# EAGLE design main-debug (EAGLE 6.4)
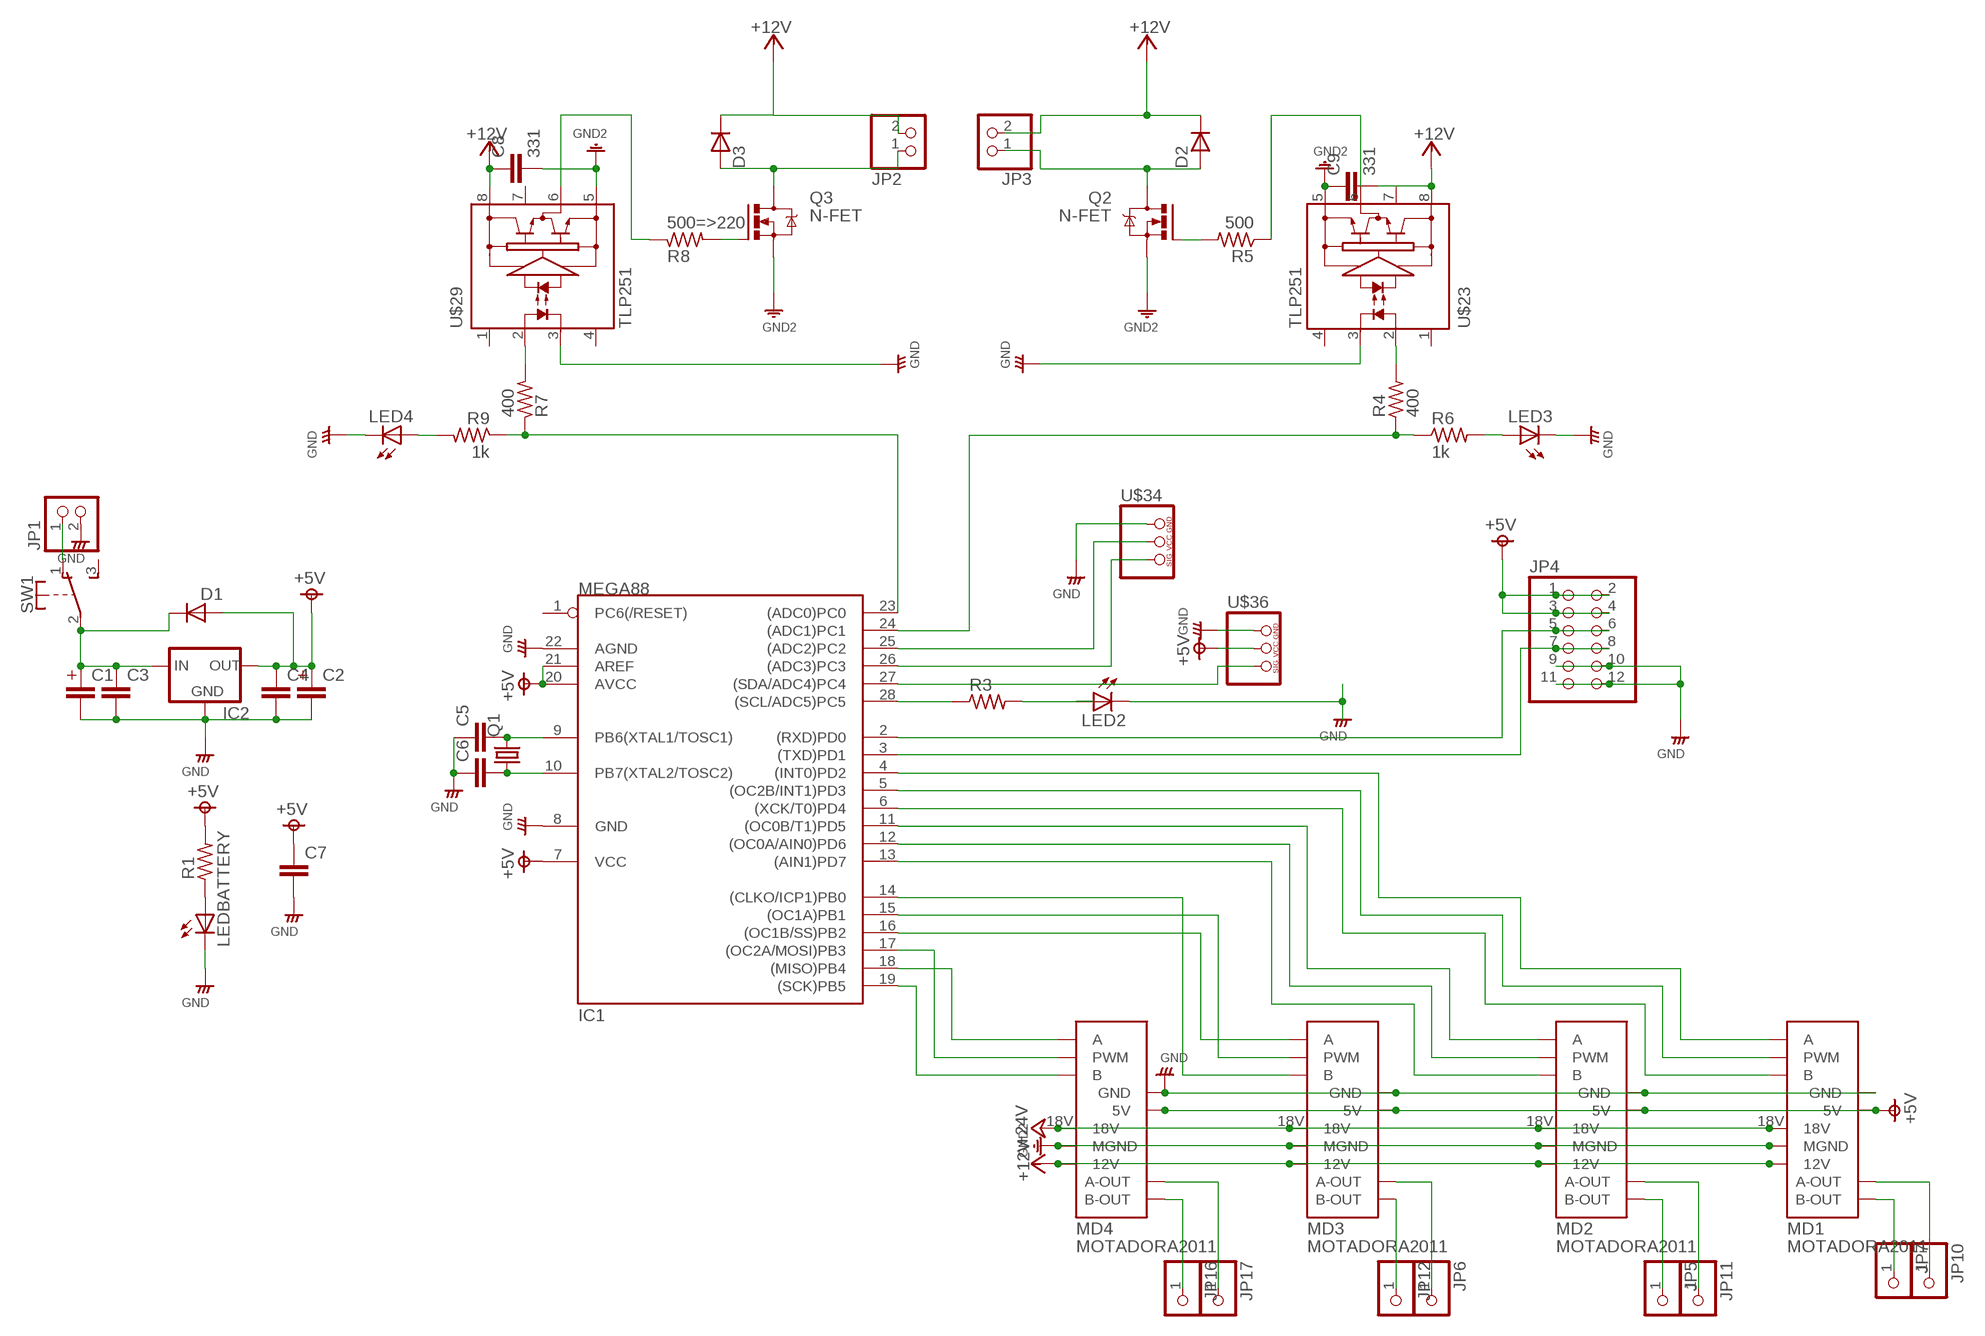
[diagram p0: schematic, sheet 1]

## Parts
C1  CAPACITOR-330U  [C_330U]
C2  CAPACITOR-330U  [C_330U]
C3  MLCC-3  [MLCC_50]
C4  MLCC-3  [MLCC_50]
C5  MLCC-2  [MLCC_25]
C6  MLCC-2  [MLCC_25]
C7  MLCC-2  [MLCC_25]
C8  331  MLCC-3  [MLCC_50]
C9  331  MLCC-3  [MLCC_50]
D1  DIODE_3  [DIODE_3]
D2  DIODE_4  [DIODE_4]
D3  DIODE_4  [DIODE_4]
IC1  MEGA88  [DIL28-3]
IC2  78  [78XX]
JP1  PINHD-1X2"  [1*02]
JP2  PINHD-1X2  [1X02]
JP3  PINHD-1X2  [1X02]
JP4  PINHD-2X6  [2X06]
JP5  PINHD-1X1  [1X01]
JP6  PINHD-1X1  [1X01]
JP7  PINHD-1X1  [1X01]
JP10  PINHD-1X1  [1X01]
JP11  PINHD-1X1  [1X01]
JP12  PINHD-1X1  [1X01]
JP16  PINHD-1X1  [1X01]
JP17  PINHD-1X1  [1X01]
LED2  LED5MM  [LED5MM]
LED3  LED5MM  [LED5MM]
LED4  LED5MM  [LED5MM]
LEDBATTERY  LED5MM  [LED5MM]
MD1  MOTADORA2011  [MOTADORA2010]
MD2  MOTADORA2011  [MOTADORA2010]
MD3  MOTADORA2011  [MOTADORA2010]
MD4  MOTADORA2011  [MOTADORA2010]
Q1  CTYSTALHC49/S  [HC49/S]
Q2  N-FET  [TO-220V]
Q3  N-FET  [TO-220V]
R1  RESISTORS-3  [R_0.3]
R3  RESISTORS-3  [R_0.3]
R4  400  RESISTORS-3  [R_0.3]
R5  500  RESISTORS-3  [R_0.3]
R6  1k  RESISTORS-3  [R_0.3]
R7  400  RESISTORS-3  [R_0.3]
R8  500=>220  RESISTORS-3  [R_0.3]
R9  1k  RESISTORS-3  [R_0.3]
SW1  TOGGLE  [9450-2]
U$23  TLP251  [DIP8]
U$29  TLP251  [DIP8]
U$34  PINHD-SENSOR  [1*03(KIKAKU)]
U$36  PINHD-SENSOR  [1*03(KIKAKU)]

## Nets
+5V: C2.P$1 C4.1 C7.1 D1.A IC1.7(VCC) IC1.20(AVCC) IC1.21(AREF) IC2.P$3(OUT) JP4.1 JP4.2 JP4.3 JP4.4 MD1.5V MD2.5V MD3.5V MD4.5V R1.2 U$36.VCC
+12V: C8.1 C9.2 D2.C D3.C JP2.2 JP3.2 MD1.12V MD2.12V MD3.12V MD4.12V U$23.8 U$29.8
+24V: MD1.18V MD2.18V MD3.18V MD4.18V
GND: C1.P$2 C2.P$2 C3.2 C4.2 C5.1 C6.1 C7.2 IC1.8(GND) IC1.22(AGND) IC2.P$2(GND) JP1.2 JP4.9 JP4.10 JP4.11 JP4.12 LED2.K(C) LED3.K(C) LED4.K(C) LEDBATTERY.K(C) MD1.GND MD2.GND MD3.GND MD4.GND U$23.3 U$29.3 U$34.GND U$36.GND
GND12: C8.2 C9.1 MD1.MGND MD2.MGND MD3.MGND MD4.MGND Q2.3(S) Q3.3(S) U$23.5 U$29.5 ; supply symbol labelled GND2
N$1: C5.2 IC1.9(PB6(XTAL1/TOSC1)) Q1.2
N$2: C6.2 IC1.10(PB7(XTAL2/TOSC2)) Q1.1
N$3: JP1.1 SW1.1(O)
N$5: C1.P$1 C3.1 D1.C IC2.P$1(IN) SW1.2(P)
N$6: IC1.27((SDA/ADC4)PC4) U$36.SIG
N$7: IC1.23((ADC0)PC0) R7.1 R9.1
N$8: IC1.24((ADC1)PC1) R4.1 R6.1
N$9: IC1.2((RXD)PD0) JP4.5 JP4.6
N$10: IC1.18((MISO)PB4) MD4.A
N$11: IC1.6((XCK/T0)PD4) MD1.B
N$12: IC1.4((INT0)PD2) MD1.A
N$13: IC1.19((SCK)PB5) MD4.B
N$14: IC1.3((TXD)PD1) JP4.7 JP4.8
N$16: IC1.28((SCL/ADC5)PC5) R3.1
N$18: IC1.5((OC2B/INT1)PD3) MD1.PWM
N$19: IC1.17((OC2A/MOSI)PB3) MD4.PWM
N$20: IC1.16((OC1B/SS)PB2) MD3.A
N$21: IC1.15((OC1A)PB1) MD3.PWM
N$22: IC1.14((CLKO/ICP1)PB0) MD3.B
N$23: IC1.13((AIN1)PD7) MD2.B
N$24: IC1.12((OC0A/AIN0)PD6) MD2.PWM
N$25: IC1.11((OC0B/T1)PD5) MD2.A
N$26: JP12.1 MD3.B-OUT
N$27: JP6.1 MD3.A-OUT
N$28: JP11.1 MD2.A-OUT
N$29: JP7.1 MD1.B-OUT
N$30: JP10.1 MD1.A-OUT
N$31: D3.A JP2.1 Q3.2(D)
N$32: Q2.1(G) R5.2
N$33: JP5.1 MD2.B-OUT
N$34: JP16.1 MD4.B-OUT
N$35: JP17.1 MD4.A-OUT
N$36: D2.A JP3.1 Q2.2(D)
N$37: R4.2 U$23.2
N$38: R5.1 U$23.6
N$39: LED3.A R6.2
N$40: LEDBATTERY.A R1.1
N$41: Q3.1(G) R8.2
N$42: IC1.25((ADC2)PC2) U$34.VCC
N$43: R7.2 U$29.2
N$44: R8.1 U$29.6
N$45: LED4.A R9.2
N$46: IC1.26((ADC3)PC3) U$34.SIG
N$47: LED2.A R3.2
Unconnected: IC1.1(PC6(/RESET)) SW1.3(S) U$23.1 U$23.4 U$23.7 U$29.1 U$29.4 U$29.7

## Library data of the parts
C1 C2 = rcl__s:CAPACITOR
C3-C9 = rcl__s:MLCC: CAPACITOR, European symbol
D1-D3 = diode_s:DIODE
IC1 = avr_s:MEGA88: MICROCONTROLLER 8 Kbytes FLASH 1 kbytes SRAM 512 bytes EEPROM USART 4-channel 10 bit ADC 2-channel 8 bit ADC Source: avr.lbr
IC2 = regulator_s:78*: VOLTAGE REGULATOR
JP1-JP3 = pinhead_s:PINHD-1X2: PIN HEADER
JP4 = pinhead_s:PINHD-2X6: PIN HEADER
JP5-JP7 JP10-JP12 JP16 JP17 = pinhead_s:PINHD-1X1: PIN HEADER
LED2-LED4 LEDBATTERY = LED_s:LED: LED OSRAM: - CHIPLED LG R971, LG N971, LY N971, LG Q971, LY Q971, LO R971, LY R971 LH N974, LH R974 LS Q976, LO Q976, LY Q976 LO Q996 - Hyper CHIPLED LW Q18S LB Q993, LB Q99A, LB R99A - SideLED LS A670, LO A670, LY A670, LG A670, LP A670 LB A673, LV A673, LT A673, LW A673 LH A674 LY A675 LS A676, LA A676, LO A676, LY A676, LW A676 LS A679, LY A679, LG A679 - Hyper Micro SIDELED® LS Y876, LA Y876, LO Y876, LY Y876 LT Y87S - SmartLED LW L88C, LW L88S LB L89C, LB L89S, LG L890 LS L89K, LO L89K, LY L89K LS L896, LA L896, LO L896, LY L896 - TOPLED LS T670, LO T670, LY T670, LG T670, LP T670 LSG T670, LSP T670, LSY T670, LOP T670, LYG T670 LG T671, LOG T671, LSG T671 LB T673, LV T673, LT T673, LW T673 LH T674 LS T676, LA T676, LO T676, LY T676, LB T676, LH T676, LSB T676, LW T676 LB T67C, LV T67C, LT T67C, LS T67K, LO T67K, LY T67K, LW E67C LS E67B, LA E67B, LO E67B, LY E67B, LB E67C, LV E67C, LT E67C LW T67C LS T679, LY T679, LG T679 LS T770, LO T770, LY T770, LG T770, LP T770 LB T773, LV T773, LT T773, LW T773 LH T774 LS E675, LA E675, LY E675, LS T675 LS T776, LA T776, LO T776, LY T776, LB T776 LHGB T686 LT T68C, LB T68C - Hyper Mini TOPLED® LB M676 - Mini TOPLED Santana® LG M470 LS M47K, LO M47K, LY M47K Source: http://www.osram.convergy.de - LUMILED® LXK2-PW12-R00, LXK2-PW12-S00, LXK2-PW14-U00, LXK2-PW14-V00 LXK2-PM12-R00, LXK2-PM12-S00, LXK2-PM14-U00 LXK2-PE12-Q00, LXK2-PE12-R00, LXK2-PE12-S00, LXK2-PE14-T00, LXK2-PE14-U00 LXK2-PB12-K00, LXK2-PB12-L00, LXK2-PB12-M00, LXK2-PB14-N00, LXK2-PB14-P00, LXK2-PB14-Q00 LXK2-PR12-L00, LXK2-PR12-M00, LXK2-PR14-Q00, LXK2-PR14-R00 LXK2-PD12-Q00, LXK2-PD12-R00, LXK2-PD12-S00 LXK2-PH12-R00, LXK2-PH12-S00 LXK2-PL12-P00, LXK2-PL12-Q00, LXK2-PL12-R00 Source: www.luxeon.com
MD1-MD4 = motadora2011:MOTADORA2011
Q1 = crystal_s:CTYSTAL: CRYSTAL
Q2 Q3 = FET_s:N-FET
R1 R3-R9 = rcl__s:RESISTORS
SW1 = switch_s:TOGGLE
U$23 U$29 = photocoupler_s:TLP251
U$34 U$36 = pinhead_s:PINHD-SENSOR

## Board
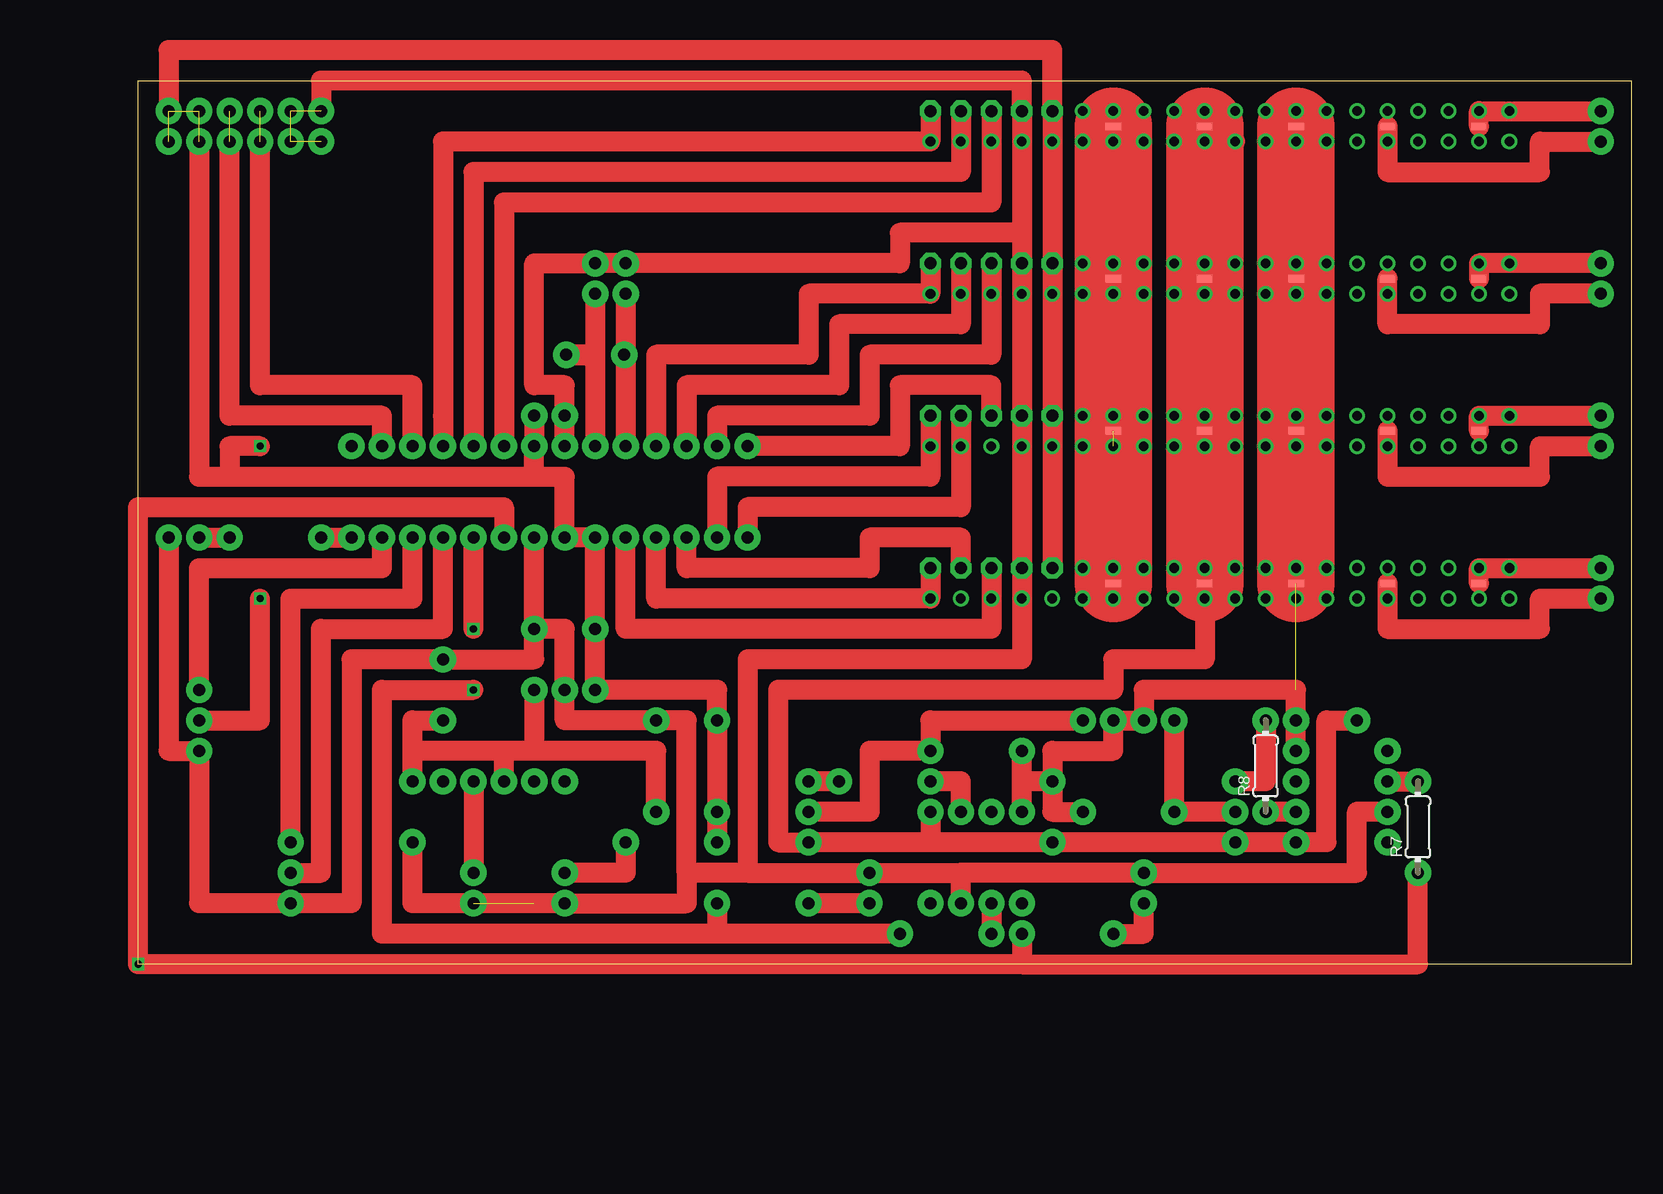
[diagram p1: board, top side]
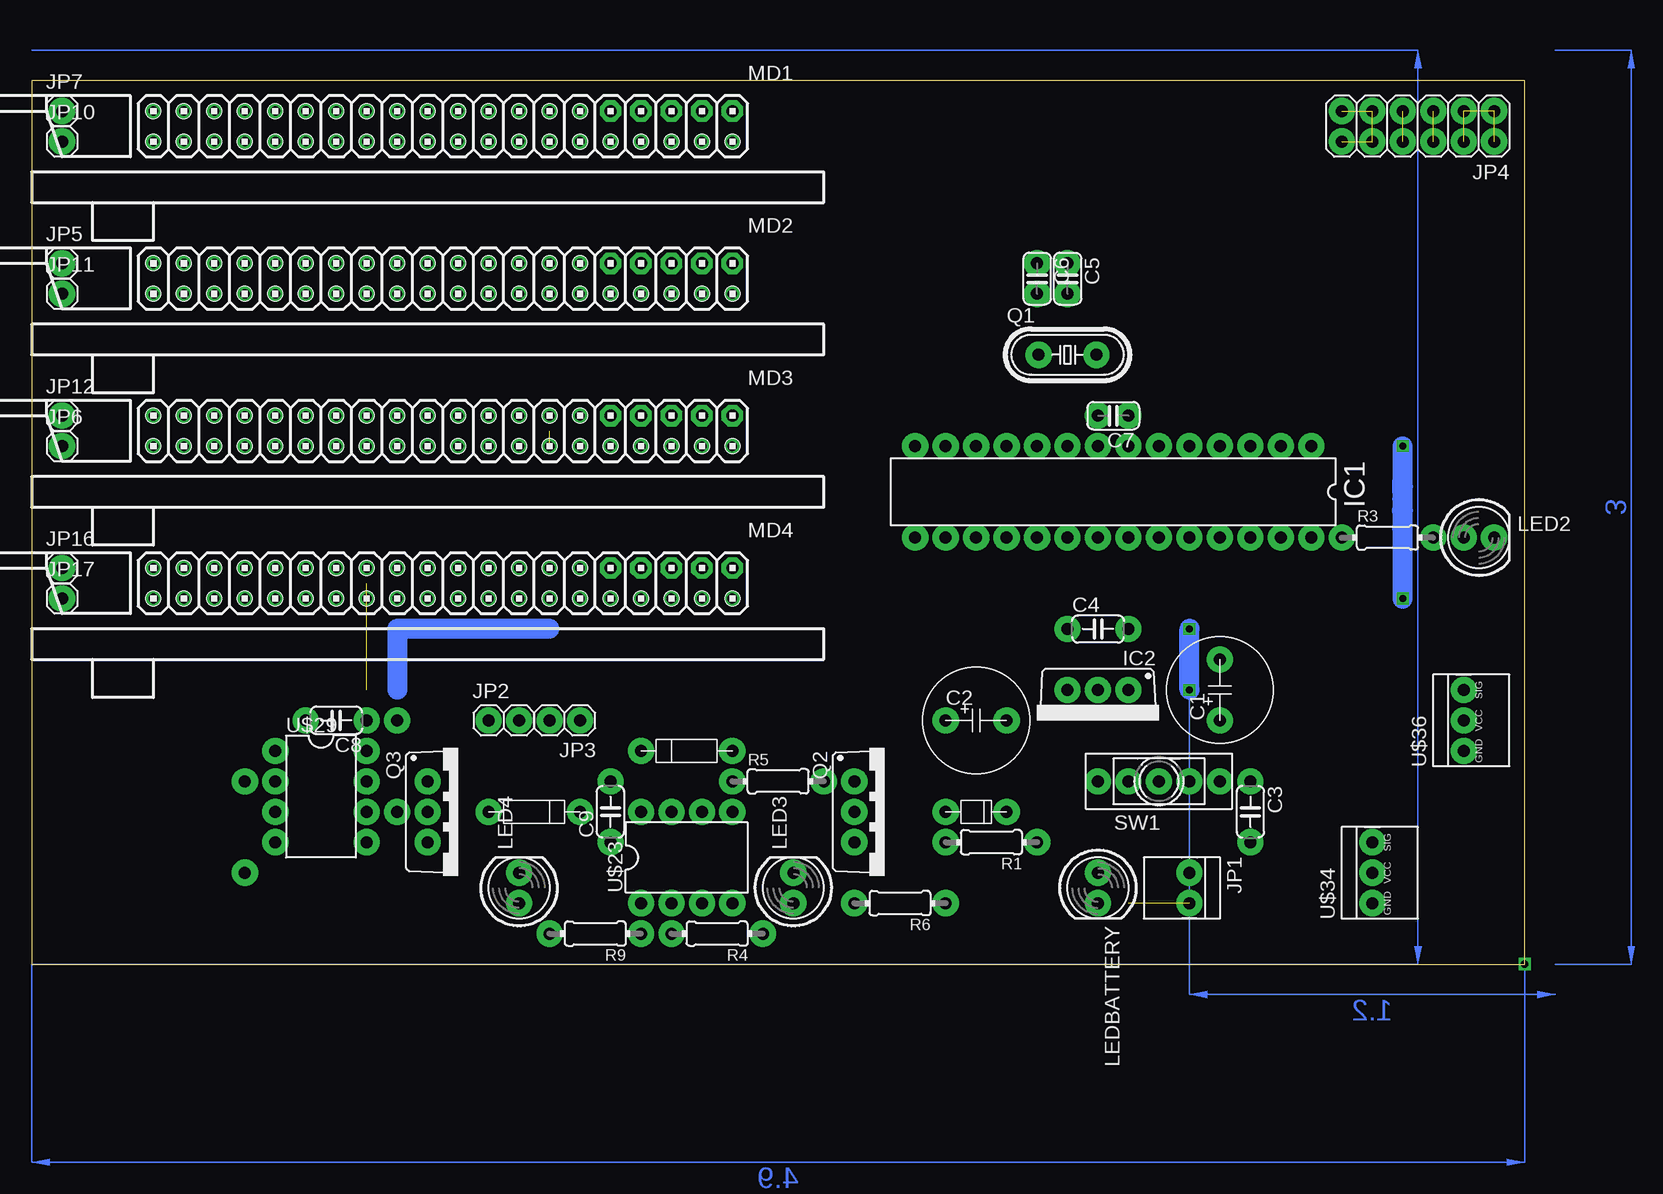
[diagram p2: board, bottom side, seen from below]

Size 124.46 x 73.66 mm. Coordinates in mm from the lower left corner, seen from the top.
Outline: 124.46,0 0,0 0,73.66 124.46,73.66 124.46,0
Copper layers (1*16): Top 0.035mm / dielectric 1.5mm / Bottom 0.035mm
Design rules "default": minimum track width 10mil, minimum drill 24mil, track to track 8mil, track to pad 8mil, pad to pad 8mil, via to via 8mil, smd to smd 8mil, copper to edge 40mil, drill to drill 8mil, minimum pad ring 10mil, minimum via ring 8mil, stop-mask expansion 4mil, vias tented up to drill 0mil, thermal gap 10mil

### Footprints (pad centres in the part's own frame; a part is rotated, then mirrored left to right if it is on the bottom)
C_330U = drill 1 pad 2.184: P$1 -2.54,0; P$2 2.54,0
MLCC_50 = drill 1 pad 2.184: 1 -2.54,0; 2 2.54,0
MLCC_25 = drill 1 pad 2.184: 1 -1.27,0; 2 1.27,0
DIODE_3 = drill 1 pad 2.184: A -2.54,0; C 2.54,0
DIODE_4 = drill 1 pad 2.184: A -5.08,0; C 2.54,0
DIL28-3 = drill 1 pad 2.184: 1 -3.81,16.51; 2 -3.81,13.97; 3 -3.81,11.43; 4 -3.81,8.89; 5 -3.81,6.35; 6 -3.81,3.81; 7 -3.81,1.27; 8 -3.81,-1.27; 9 -3.81,-3.81; 10 -3.81,-6.35; 11 -3.81,-8.89; 12 -3.81,-11.43; 13 -3.81,-13.97; 14 -3.81,-16.51; 15 3.81,-16.51; 16 3.81,-13.97; 17 3.81,-11.43; 18 3.81,-8.89; 19 3.81,-6.35; 20 3.81,-3.81; 21 3.81,-1.27; 22 3.81,1.27; 23 3.81,3.81; 24 3.81,6.35; 25 3.81,8.89; 26 3.81,11.43; 27 3.81,13.97; 28 3.81,16.51
78XX = drill 1 pad 2.184: P$1 -2.54,0; P$2 0,0; P$3 2.54,0
1*02 = drill 1 pad 2.184: 1 -1.27,0; 2 1.27,0
1X02 = drill 1 pad 2.184: 1 -1.27,0; 2 1.27,0
2X06 = drill 1 pad 2.184: 1 -6.35,-1.27; 2 -6.35,1.27; 3 -3.81,-1.27; 4 -3.81,1.27; 5 -1.27,-1.27; 6 -1.27,1.27; 7 1.27,-1.27; 8 1.27,1.27; 9 3.81,-1.27; 10 3.81,1.27; 11 6.35,-1.27; 12 6.35,1.27
1X01 = drill 1 pad 2.184: 1 0,0
LED5MM = drill 1 pad 2.184: A -1.27,0; K 1.27,0
MOTADORA2010 = drill 1.001 pad 1.778 octagon: 5V -15.24,-1.27; A -25.4,-1.27; B -20.32,-1.27; GND -17.78,-1.27; PWM -22.86,-1.27 | smd 1.27 x 0.635 bottom: 12V 5.08,0; 18V -10.16,0; A-OUT 12.7,0; B-OUT 20.32,0; MGND -2.54,0 | drill 0.8: P$1 -25.4,1.27; P$2 -22.86,1.27; P$3 -20.32,1.27; P$4 -17.78,1.27; P$5 -15.24,1.27; P$6 -12.7,1.27; P$7 -12.7,-1.27; P$8 -10.16,-1.27; P$9 -10.16,1.27; P$10 -7.62,1.27; P$11 -7.62,-1.27; P$12 -5.08,-1.27; P$13 -5.08,1.27; P$14 -2.54,1.27; P$15 -2.54,-1.27; P$16 0,-1.27; P$17 0,1.27; P$18 2.54,1.27; P$19 5.08,1.27; P$20 5.08,-1.27; P$21 2.54,-1.27; P$22 7.62,-1.27; P$23 7.62,1.27; P$24 10.16,1.27; P$25 10.16,-1.27; P$26 12.7,1.27; P$27 12.7,-1.27; P$28 15.24,-1.27; P$29 15.24,1.27; P$30 17.78,1.27; P$31 17.78,-1.27; P$32 20.32,-1.27; P$33 20.32,1.27; P$34 22.86,1.27; P$35 22.86,-1.27
HC49/S = drill 1 pad 2.184: 1 -2.413,0; 2 2.413,0
TO-220V = drill 1 pad 2.184: 1 -2.54,0; 2 0,0; 3 2.54,0
R_0.3 = drill 1 pad 2.184: 1 -3.81,0; 2 3.81,0; 3 -3.81,0
9450-2 = drill 1 pad 2.184: 1 -2.54,0; 2 0,0; 3 2.54,0; F1 -5.08,0; F2 5.08,0
DIP8 = drill 1 pad 2.184: 1 -3.81,-3.81; 2 -1.27,-3.81; 3 1.27,-3.81; 4 3.81,-3.81; 5 3.81,3.81; 6 1.27,3.81; 7 -1.27,3.81; 8 -3.81,3.81
1*03(KIKAKU) = drill 1 pad 2.184: GND -2.54,1.27; SIG 2.54,1.27; VCC 0,1.27

### Placement (x,y rotation side)
C1  25.4,22.86 90 bottom
C2  45.72,20.32 0 bottom
C3  22.86,12.7 270 bottom
C4  35.56,27.94 0 bottom
C5  38.1,57.15 270 bottom
C6  40.64,57.15 270 bottom
C7  34.29,45.72 180 bottom
C8  99.06,20.32 180 bottom
C9  76.2,12.7 90 bottom
D1  45.72,12.7 0 bottom
D2  71.12,17.78 180 bottom
D3  81.28,12.7 0 bottom
IC1  34.29,39.37 270 bottom
IC2  35.56,22.86 180 bottom
JP1  27.94,6.35 270 bottom
JP2  85.09,20.32 0 bottom
JP3  80.01,20.32 180 bottom
JP4  8.89,69.85 180 bottom
JP5  121.92,58.42 0 bottom
JP6  121.92,43.18 0 bottom
JP7  121.92,71.12 0 bottom
JP10  121.92,68.58 0 bottom
JP11  121.92,55.88 0 bottom
JP12  121.92,45.72 0 bottom
JP16  121.92,33.02 0 bottom
JP17  121.92,30.48 0 bottom
LED2  3.81,35.56 0 bottom
LED3  60.96,6.35 90 bottom
LED4  83.82,6.35 90 bottom
LEDBATTERY  35.56,6.35 270 bottom
MD1  91.44,69.85 180 bottom
MD2  91.44,57.15 180 bottom
MD3  91.44,44.45 180 bottom
MD4  91.44,31.75 180 bottom
Q1  38.1,50.8 0 bottom
Q2  55.88,12.7 270 bottom
Q3  91.44,12.7 270 bottom
R1  44.45,10.16 180 bottom
R3  11.43,35.56 0 bottom
R4  67.31,2.54 180 bottom
R5  62.23,15.24 0 bottom
R6  52.07,5.08 180 bottom
R7  106.68,11.43 90 top
R8  93.98,16.51 90 top
R9  77.47,2.54 180 bottom
SW1  30.48,15.24 180 bottom
U$23  69.85,8.89 0 bottom
U$29  100.33,13.97 270 bottom
U$34  11.43,7.62 90 bottom
U$36  3.81,20.32 90 bottom

### Tracks (layer width: path | path; a pad name or v marks a point on that pad's centre or on a via)
+5V  (via drill 0.6)  (3 unrouted)
  Top 1.676: C7.1 IC1.7 33.02,40.64 | JP4.4 5.08,40.64 7.62,40.64 | 7.62,40.64 33.02,40.64 | R1.2 D1.A C2.P$1 48.26,22.86 IC2.P$3 C4.1 IC1.20 IC1.21 35.56,40.64 33.02,40.64 | MD4.5V MD3.5V MD2.5V MD1.5V 76.2,76.2 2.54,76.2 JP4.1 | U$36.VCC 10.16,20.32 v10.16,30.48 | v10.16,43.18 7.62,43.18 7.62,40.64
  Bottom 1.676: v10.16,30.48 v10.16,43.18
+12V  (1 unrouted)
  Top 1.676: U$29.8 C8.1 96.52,22.86 83.82,22.86 JP2.2 JP3.2 81.28,17.78 76.2,17.78 C9.2 | U$23.8 73.66,15.24 | C9.2 73.66,15.24 | 73.66,15.24 D2.C | C9.2 76.2,12.7 D3.C
  Top 6.452: MD1.12V MD2.12V MD3.12V MD4.12V
+24V  (1 unrouted)
  Top 0.406: MD1.18V 78.74,69.85 78.74,53.34 81.28,53.34 83.82,53.34 | 83.82,53.34 83.82,43.18 | 83.82,43.18 83.82,40.64 | 83.82,60.96 83.82,53.34 | 83.82,43.18 81.28,43.18
  Top 6.452: MD1.18V MD2.18V 81.28,53.34 81.28,43.18 MD4.18V
GND  (via drill 0.6)  (4 unrouted)
  Top 1.676: 73.66,60.96 MD1.GND 73.66,73.66 15.24,73.66 JP4.11 | 73.66,60.96 MD2.GND MD3.GND MD4.GND 73.66,25.4 50.8,25.4 50.8,7.62 | U$29.3 101.6,12.7 101.6,7.62 LED4.K 68.58,7.62 | LEDBATTERY.K 22.86,5.08 C3.2 | LEDBATTERY.K 33.02,5.08 | LEDBATTERY.K 45.72,5.08 45.72,7.62 | 45.72,7.62 45.72,20.32 C2.P$2 35.56,20.32 IC2.P$2 35.56,27.94 C4.2 | 50.8,7.62 45.72,7.62 | C4.2 33.02,25.4 C1.P$2 17.78,25.4 17.78,5.08 U$34.GND 5.08,5.08 U$36.GND 2.54,17.78 LED2.K | C4.2 IC1.22 | 50.8,7.62 LED3.K 68.58,7.62 | U$23.3 68.58,7.62 | 73.66,60.96 63.5,60.96 63.5,58.42 C6.1 C5.1 33.02,58.42 33.02,48.26 35.56,48.26 C7.2 IC1.8
  other vias: 60.96,7.62
GND12  (via drill 0.6)
  Top 0.406: MD3.MGND 88.9,60.96
  Top 1.676: MD1.MGND 91.44,68.58 | C8.2 99.06,20.32 99.06,10.16 U$29.5 Q3.3 C9.1 66.04,10.16 | U$23.5 66.04,10.16 | 66.04,10.16 Q2.3 53.34,10.16 53.34,22.86 81.28,22.86 81.28,25.4 88.9,25.4 MD4.MGND
  Top 6.452: MD1.MGND 88.9,60.96 MD2.MGND MD3.MGND MD4.MGND
  other vias: 76.2,10.16 76.2,10.16
N$1
  Top 1.676: C5.2 38.1,50.8 Q1.2 38.1,50.67 IC1.9
N$2
  Top 1.676: IC1.10 C6.2 40.64,50.8 Q1.1
N$3
  Top 1.676: SW1.1 JP1.1
N$4
  Bottom 1.676: 81.28,27.94 93.98,27.94 93.98,22.86
N$5
  Top 1.676: D1.C 43.18,17.78 33.02,17.78 | C3.1 22.86,17.78 | SW1.2 30.48,17.78 | 30.48,17.78 22.86,17.78 | IC2.P$1 33.02,17.78 | 33.02,17.78 30.48,17.78 | 22.86,17.78 22.86,20.32 C1.P$1
N$6
  Top 1.676: IC1.27 20.32,33.02 5.08,33.02 U$36.SIG
N$7  (via drill 0.6)
  Top 1.676: IC1.23 30.48,38.1 0,38.1 v0,0 73.66,0 | R9.1 73.66,0 | 73.66,0 106.68,0 R7.1
N$8  (via drill 0.6)
  Top 1.676: R4.1 48.26,2.54 | R6.1 48.26,2.54 | 48.26,2.54 20.32,2.54 20.32,22.86 v27.94,22.86 | v27.94,27.94 IC1.24
  Bottom 1.676: v27.94,22.86 v27.94,27.94
N$9  (1 unrouted)
  Top 1.676: IC1.2 20.32,45.72 7.62,45.72 JP4.6
N$10
  Top 1.676: IC1.18 43.18,30.48 66.04,30.48 MD4.A
N$11
  Top 1.676: MD1.B 71.12,63.5 30.48,63.5 IC1.6
N$12
  Top 1.676: MD1.A 66.04,68.58 25.4,68.58 IC1.4 25.4,45.72
N$13
  Top 1.676: MD4.B 71.12,27.94 40.64,27.94 IC1.19
N$14  (1 unrouted)
  Top 1.676: IC1.3 22.86,48.26 10.16,48.26 JP4.8
N$16
  Top 1.676: R3.1 IC1.28
N$18
  Top 1.676: MD1.PWM 68.58,66.04 27.94,66.04 IC1.5
N$19
  Top 1.676: MD4.PWM 68.58,35.56 60.96,35.56 60.96,33.02 45.72,33.02 IC1.17
N$20
  Top 1.676: IC1.16 48.26,40.64 66.04,40.64 MD3.A
N$21
  Top 1.676: MD3.PWM 68.58,38.1 50.8,38.1 IC1.15
N$22
  Top 1.676: MD3.B 71.12,48.26 63.5,48.26 63.5,43.18 IC1.14
N$23
  Top 1.676: MD2.B 71.12,50.8 60.96,50.8 60.96,45.72 48.26,45.72 IC1.13
N$24
  Top 1.676: IC1.12 45.72,48.26 58.42,48.26 58.42,53.34 68.58,53.34 MD2.PWM
N$25
  Top 1.676: MD2.A 66.04,55.88 55.88,55.88 55.88,50.8 43.18,50.8 IC1.11
N$26
  Top 1.676: MD3.B-OUT 111.76,45.72 JP12.1
N$27
  Top 1.676: MD3.A-OUT 104.14,40.64 116.84,40.64 116.84,43.18 JP6.1
N$28
  Top 1.676: JP11.1 116.84,55.88 116.84,53.34 104.14,53.34 MD2.A-OUT
N$29
  Top 1.676: MD1.B-OUT 111.76,71.12 JP7.1
N$30
  Top 1.676: MD1.A-OUT 104.14,66.04 116.84,66.04 116.84,68.58 JP10.1
N$31  (via drill 0.6)
  Top 1.676: Q3.2 D3.A JP2.1
  other vias: 91.44,12.7 86.36,12.7
N$32
  Top 1.676: R5.2 Q2.1
N$33
  Top 1.676: JP5.1 111.76,58.42 MD2.B-OUT
N$34
  Top 1.676: MD4.B-OUT 111.76,33.02 JP16.1
N$35
  Top 1.676: MD4.A-OUT 104.14,27.94 116.84,27.94 116.84,30.48 JP17.1
N$36
  Top 1.676: Q2.2 60.96,12.7 60.96,17.78 D2.A 66.04,20.32 JP3.1
N$37
  Top 1.676: U$23.2 R4.2
N$38
  Top 1.676: U$23.6 68.58,15.24 R5.1
N$39
  Top 1.676: LED3.A R6.2
N$40
  Top 1.676: R1.1 40.64,7.62 LEDBATTERY.A
N$41
  Top 1.676: R8.2 93.98,15.24 Q3.1
N$42
  Top 1.676: U$34.VCC 15.24,7.62 15.24,27.94 25.4,27.94 IC1.25
N$43
  Top 1.676: U$29.2 R7.2
N$44
  Top 1.676: U$29.6 R8.1
N$45
  Top 1.676: R9.2 83.82,2.54 LED4.A
N$46
  Top 1.676: U$34.SIG 12.7,30.48 22.86,30.48 IC1.26
N$47
  Top 1.676: LED2.A R3.2
(copper drawn outside any net)
  shapes: Bottom area x4